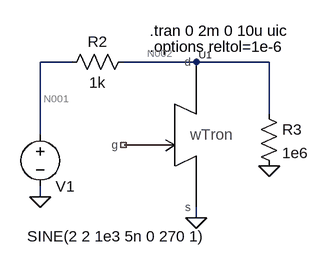
[diagram p0: schematic wTron_no_coax.asc]
wTron_no_coax.asc, the LTspice schematic file:
Version 4
SHEET 1 880 680
WIRE -208 224 -256 224
WIRE -16 224 -128 224
WIRE 96 224 -16 224
WIRE 96 304 96 224
WIRE -256 336 -256 224
WIRE -256 432 -256 416
WIRE -16 464 -16 448
FLAG -256 432 0
FLAG 96 384 0
FLAG -16 464 0
SYMBOL res 80 288 R0
SYMATTR InstName R3
SYMATTR Value 1e6
SYMBOL voltage -256 320 R0
WINDOW 0 24 96 Left 2
WINDOW 3 -20 173 Left 2
WINDOW 123 0 0 Left 0
WINDOW 39 24 -12 Left 2
SYMATTR InstName V1
SYMATTR Value SINE(2 2 1e3 5n 0 270 1)
SYMBOL res -112 208 R90
WINDOW 0 0 56 VBottom 2
WINDOW 3 32 56 VTop 2
SYMATTR InstName R2
SYMATTR Value 1k
SYMBOL wtron -16 336 R0
SYMATTR Value ""
SYMATTR SpiceLine ""
SYMATTR Value2 ""
SYMATTR InstName U1
TEXT -88 176 Left 2 !.tran 0 2m 0 10u uic
TEXT -88 200 Left 2 !.options reltol=1e-6

The netlist it stands for:
* wTron_no_coax.asc
R3 N002 0 1e6
V1 N001 0 SINE(2 2 1e3 5n 0 270 1)
R2 N002 N001 1k
XU1 NC_01 N002 0 wtron  ; pins g d s
.tran 0 2m 0 10u uic
.options reltol=1e-6
.lib wtron.lib
.backanno
.end

* Results of the author's LTspice run, read from the files saved beside the schematic
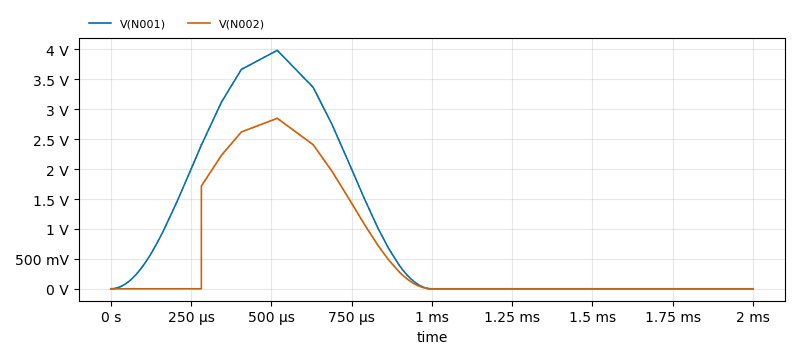
[diagram p1: Transient Analysis of wTron_no_coax.asc, plotted from the saved traces]
* Transient Analysis, 1 run:
*   V(N001): min 0 V, max 3.984 V, average 990.4 mV, rms 1.716 V, last 0 V
*   V(N002): min -902.2 nV, max 2.849 V, average 617.9 mV, rms 1.186 V, last 0 V